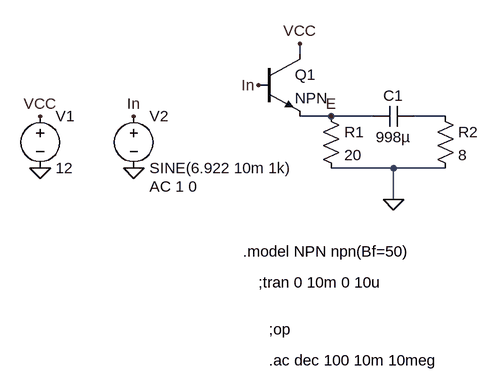
[diagram p0: schematic estagio3.asc]
estagio3.asc, the LTspice schematic file:
Version 4
SHEET 1 880 680
WIRE 272 112 272 96
WIRE 320 208 272 208
WIRE 384 208 320 208
WIRE 496 208 448 208
WIRE 416 288 320 288
WIRE 496 288 416 288
WIRE 416 336 416 288
FLAG 416 336 0
FLAG -128 288 0
FLAG 16 288 0
FLAG 320 208 E
FLAG -128 208 VCC
FLAG 272 96 VCC
FLAG 16 208 In
FLAG 208 160 In
SYMBOL npn 208 112 R0
SYMATTR InstName Q1
SYMBOL voltage -128 192 R0
WINDOW 123 0 0 Left 0
WINDOW 39 0 0 Left 0
SYMATTR InstName V1
SYMATTR Value 12
SYMBOL voltage 16 192 R0
WINDOW 123 24 124 Left 2
WINDOW 39 0 0 Left 0
SYMATTR Value2 AC 1 0
SYMATTR InstName V2
SYMATTR Value SINE(6.922 10m 1k)
SYMBOL res 304 192 R0
SYMATTR InstName R1
SYMATTR Value 20
SYMBOL res 480 192 R0
SYMATTR InstName R2
SYMATTR Value 8
SYMBOL cap 448 192 R90
WINDOW 0 0 32 VBottom 2
WINDOW 3 32 32 VTop 2
SYMATTR InstName C1
SYMATTR Value 998µ
TEXT 184 416 Left 2 !.model NPN npn(Bf=50)
TEXT 208 464 Left 2 !;tran 0 10m 0 10u
TEXT 224 536 Left 2 !;op
TEXT 224 584 Left 2 !.ac dec 100 10m 10meg

The netlist it stands for:
* estagio3.asc
Q1 VCC In E 0 NPN
V1 VCC 0 12
V2 In 0 SINE(6.922 10m 1k) AC 1 0
R1 E 0 20
R2 N001 0 8
C1 N001 E 998µ
.model NPN NPN
.model PNP PNP
.lib standard.bjt
.model NPN npn(Bf=50)
;tran 0 10m 0 10u
;op
.ac dec 100 10m 10meg
.backanno
.end